# EAGLE schematic robot (EAGLE 8.3.0)
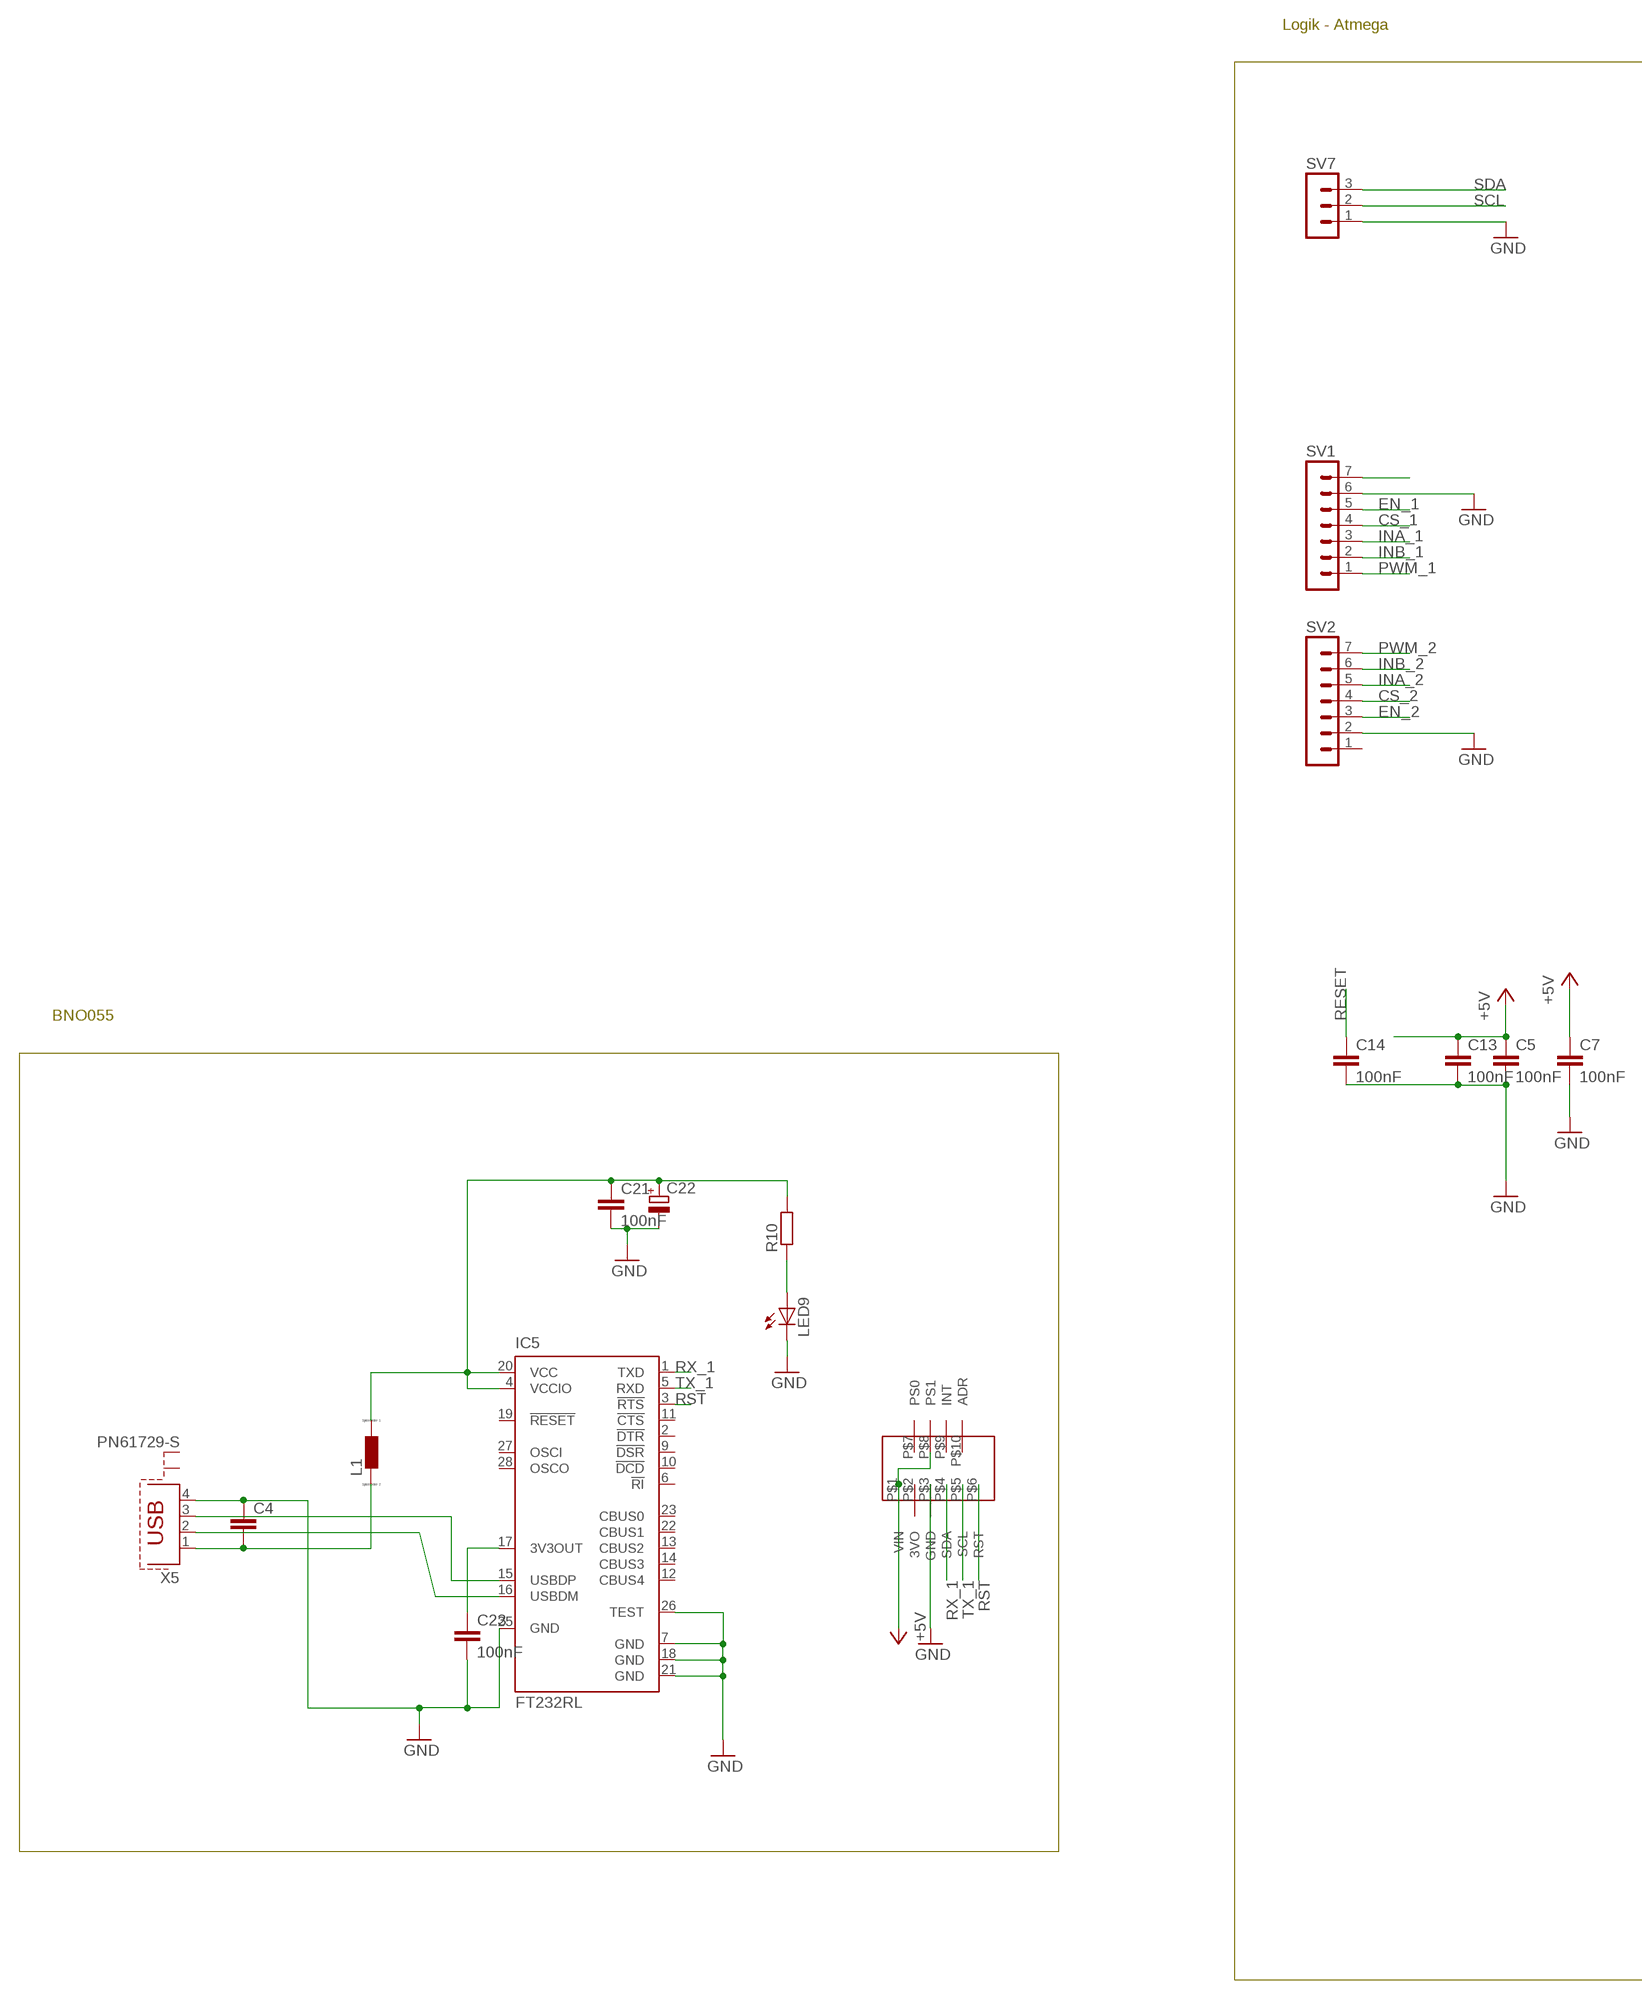
[diagram p0: schematic, sheet 1, part 1 of 3]
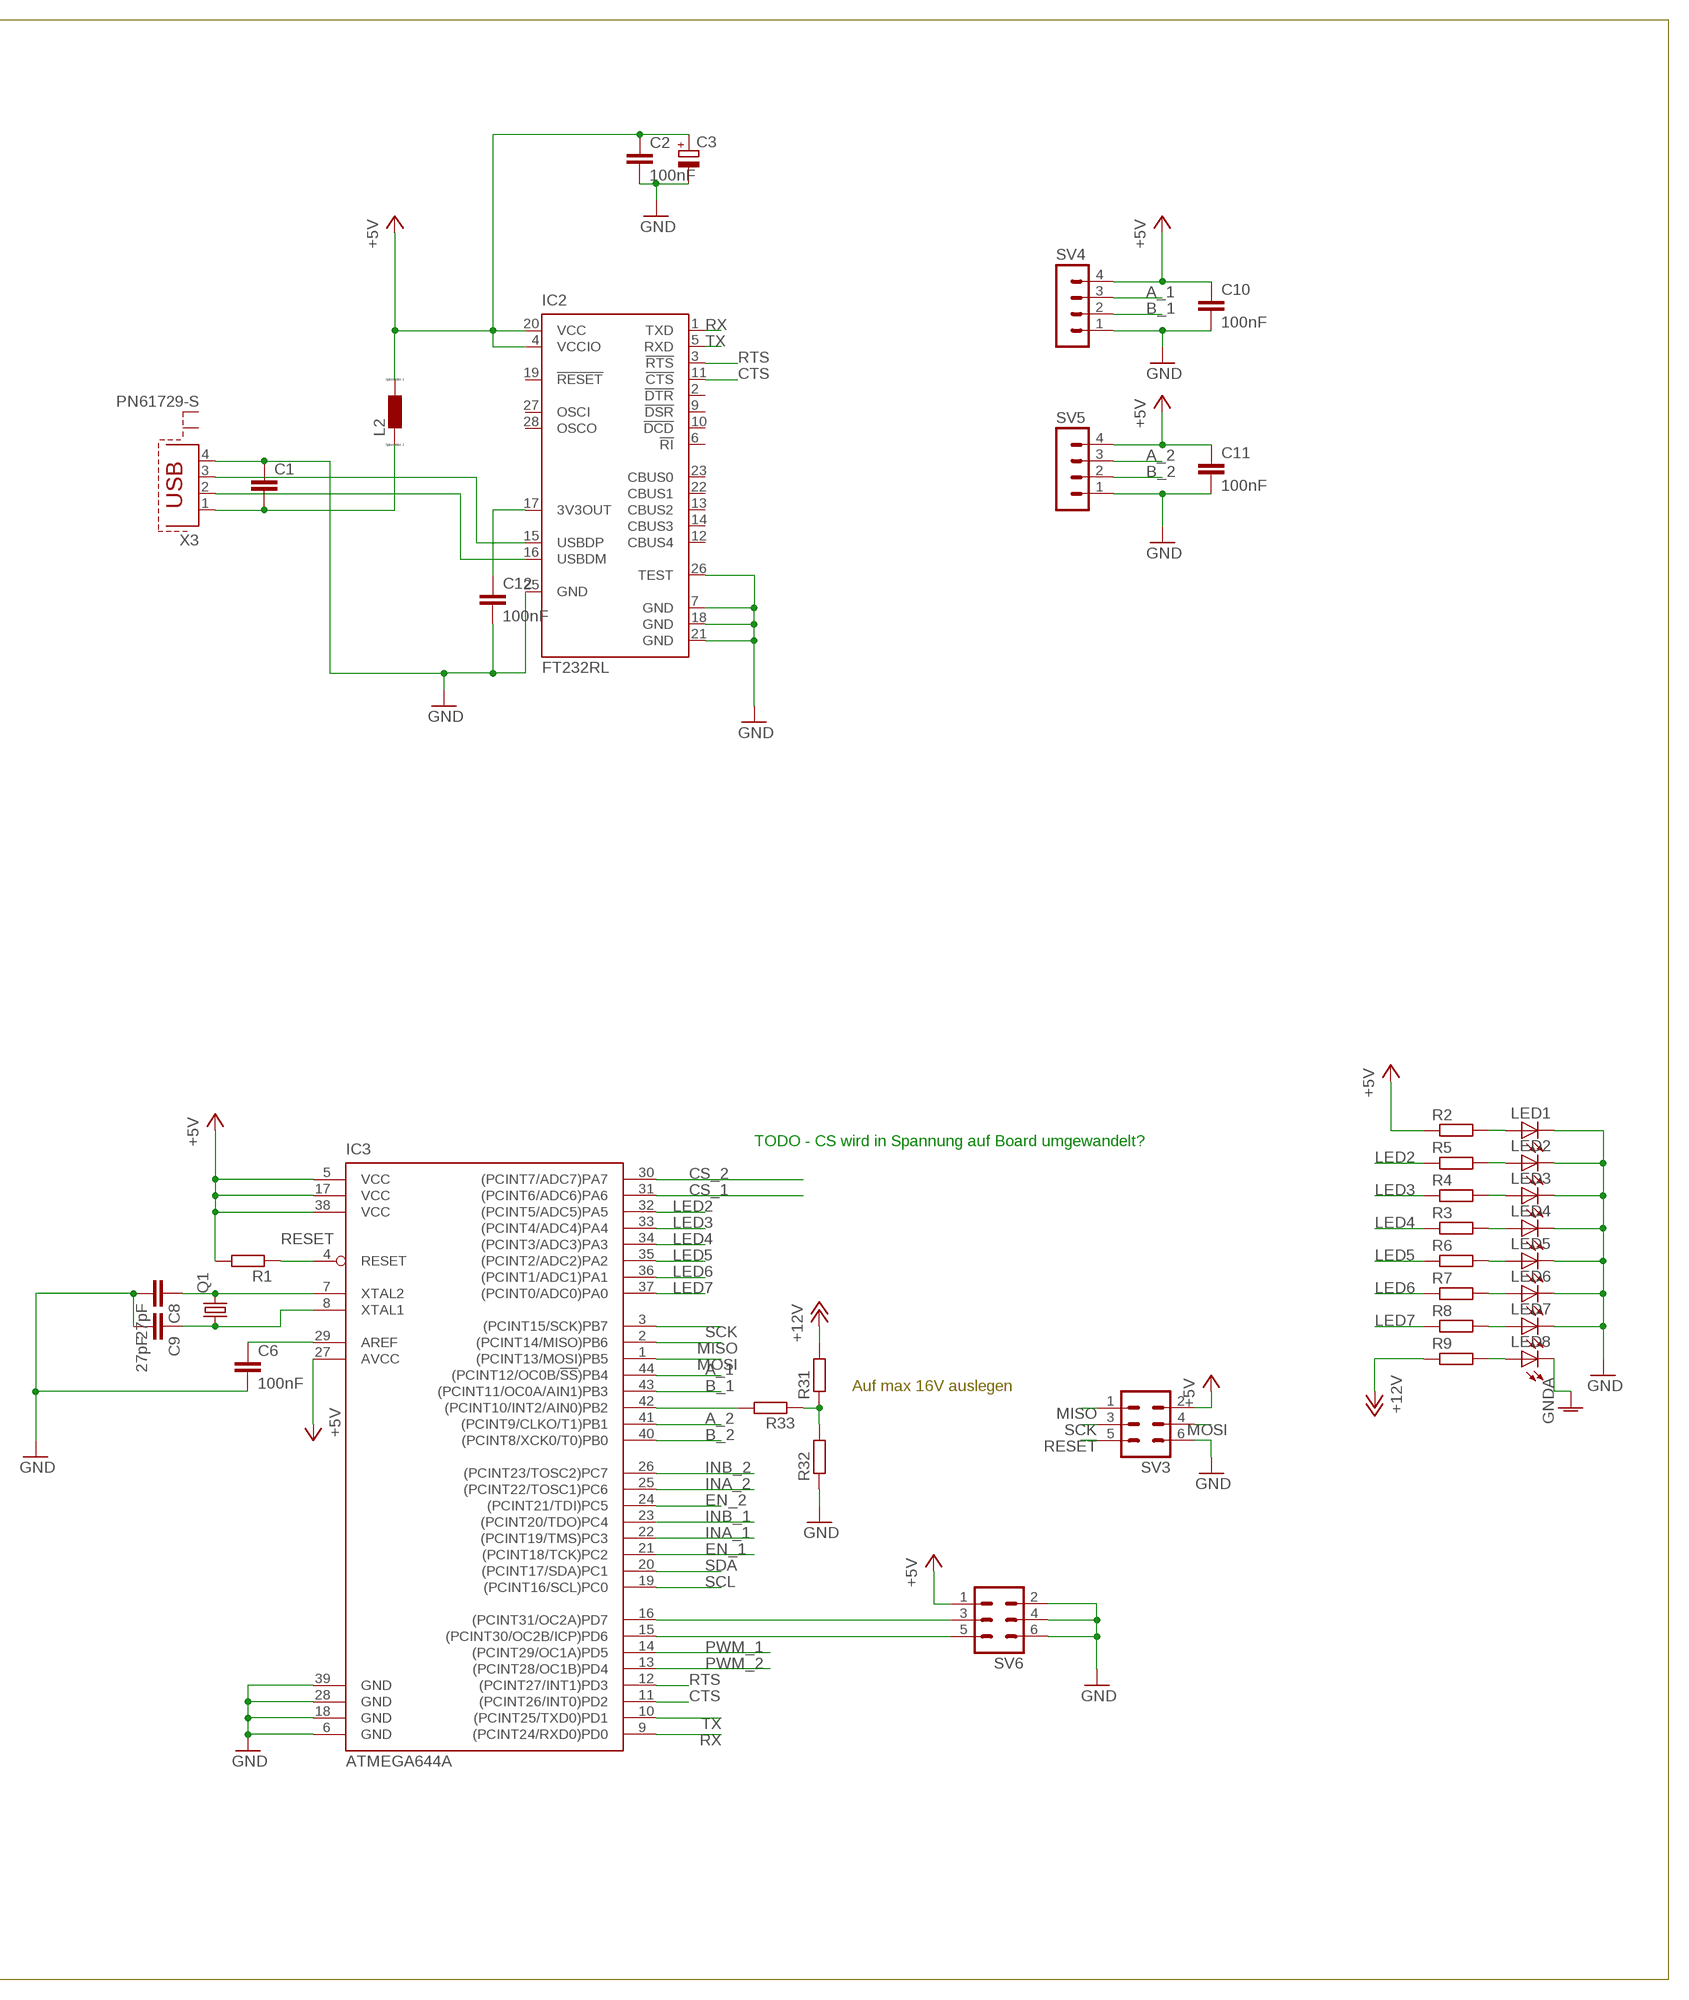
[diagram p1: schematic, sheet 1, part 2 of 3]
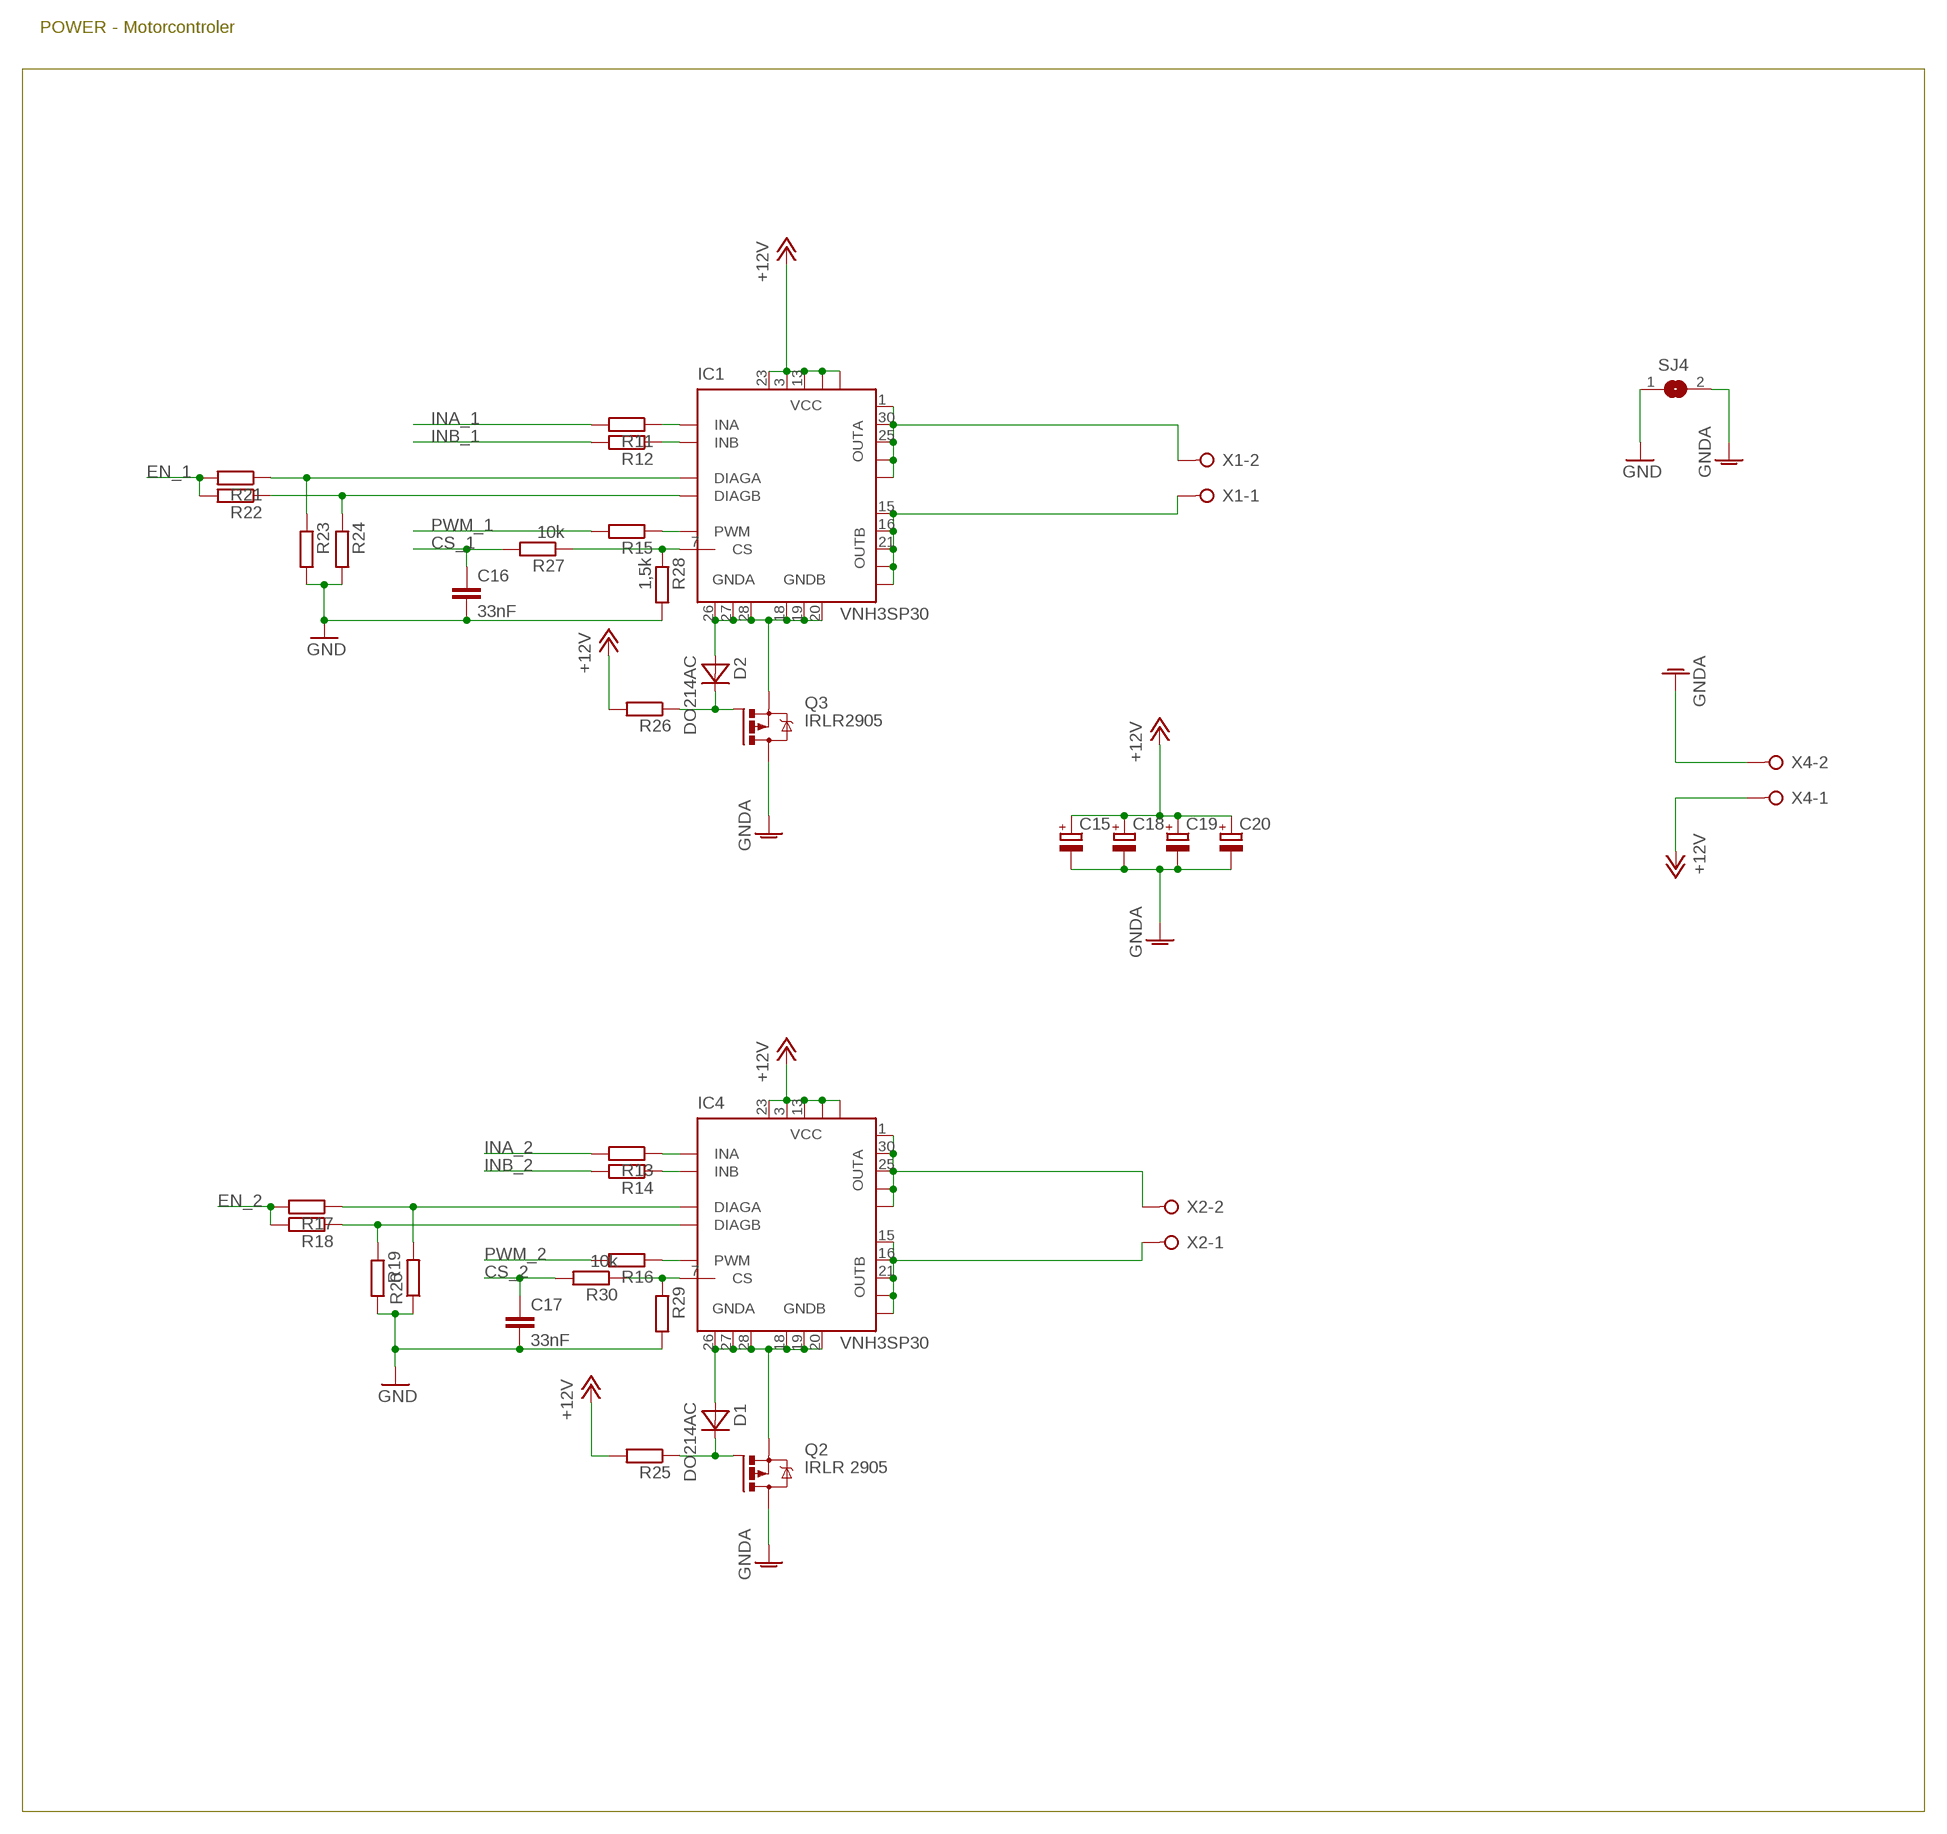
[diagram p2: schematic, sheet 1, part 3 of 3]

## Parts
C1  C-EUC0805  [C0805]
C2  100nF  C-EUC0805  [C0805]
C3  CPOL-EU153CLV-0810  [153CLV-0810]
C4  C-EUC0805  [C0805]
C5  100nF  C-EUC0805  [C0805]
C6  100nF  C-EUC0805  [C0805]
C7  100nF  C-EUC0805  [C0805]
C8  27pF  C-EUC0805  [C0805]
C9  27pF  C-EUC0805  [C0805]
C10  100nF  C-EUC0805  [C0805]
C11  100nF  C-EUC0805  [C0805]
C12  100nF  C-EUC0805  [C0805]
C13  100nF  C-EUC0805  [C0805]
C14  100nF  C-EUC0805  [C0805]
C15  CPOL-EU153CLV-0810  [153CLV-0810]
C16  33nF  C-EUC0805  [C0805]
C17  33nF  C-EUC0805  [C0805]
C18  CPOL-EU153CLV-0810  [153CLV-0810]
C19  CPOL-EU153CLV-0810  [153CLV-0810]
C20  CPOL-EU153CLV-0810  [153CLV-0810]
C21  100nF  C-EUC0805  [C0805]
C22  CPOL-EU153CLV-0810  [153CLV-0810]
C23  100nF  C-EUC0805  [C0805]
D1  DO214AC  MBRA340T3  [SMA]
D2  DO214AC  MBRA340T3  [SMA]
IC1  VNH3SP30  [MULTIPOWERSO-30]
IC2  FT232RL  [SSOP28]
IC3  ATMEGA644A  [TQFP44]
IC4  VNH3SP30  [MULTIPOWERSO-30]
IC5  FT232RL  [SSOP28]
L1  LL4532C  [L4532M]
L2  LL4532C  [L4532M]
LED1  LEDCHIPLED_0805  [CHIPLED_0805]
LED2  LEDCHIPLED_0805  [CHIPLED_0805]
LED3  LEDCHIPLED_0805  [CHIPLED_0805]
LED4  LEDCHIPLED_0805  [CHIPLED_0805]
LED5  LEDCHIPLED_0805  [CHIPLED_0805]
LED6  LEDCHIPLED_0805  [CHIPLED_0805]
LED7  LEDCHIPLED_0805  [CHIPLED_0805]
LED8  LEDCHIPLED_0805  [CHIPLED_0805]
LED9  LEDCHIPLED_0805  [CHIPLED_0805]
Q1  CRYSTALHC49UP  [HC49UP]
Q2  IRLR 2905  IRFR5305  [D-PAK_TO252AA]
Q3  IRLR2905  IRFR5305  [D-PAK_TO252AA]
R1  R-EU_M0805  [M0805]
R2  R-EU_M0805  [M0805]
R3  R-EU_M0805  [M0805]
R4  R-EU_M0805  [M0805]
R5  R-EU_M0805  [M0805]
R6  R-EU_M0805  [M0805]
R7  R-EU_M0805  [M0805]
R8  R-EU_M0805  [M0805]
R9  R-EU_M0805  [M0805]
R10  R-EU_M0805  [M0805]
R11  R-EU_M0805  [M0805]
R12  R-EU_M0805  [M0805]
R13  R-EU_M0805  [M0805]
R14  R-EU_M0805  [M0805]
R15  R-EU_M0805  [M0805]
R16  R-EU_M0805  [M0805]
R17  R-EU_M0805  [M0805]
R18  R-EU_M0805  [M0805]
R19  R-EU_M0805  [M0805]
R20  R-EU_M0805  [M0805]
R21  R-EU_M0805  [M0805]
R22  R-EU_M0805  [M0805]
R23  R-EU_M0805  [M0805]
R24  R-EU_M0805  [M0805]
R25  R-EU_M0805  [M0805]
R26  R-EU_M0805  [M0805]
R27  10k  R-EU_M0805  [M0805]
R28  1,5k  R-EU_M0805  [M0805]
R29  R-EU_M0805  [M0805]
R30  10k  R-EU_M0805  [M0805]
R31  R-EU_M0805  [M0805]
R32  R-EU_M0805  [M0805]
R33  R-EU_M0805  [M0805]
SJ4  SJ  [SJ]
SV1  MA07-1  [MA07-1]
SV2  MA07-1  [MA07-1]
SV3  ML6  [ML6]
SV4  MA04-1  [MA04-1]
SV5  MA04-1  [MA04-1]
SV6  ML6  [ML6]
SV7  MA03-1  [MA03-1]
U$1  BNO055  [BNO055_ADA]
X1  W237-02P  [W237-132]
X2  W237-02P  [W237-132]
X3  PN61729-S  [PN61729-S]
X4  W237-02P  [W237-132]
X5  PN61729-S  [PN61729-S]

## Nets
+5V: C2.1 C3.+ C5.1 C7.1 C10.1 C11.1 C13.1 IC2.4(VCCIO) IC2.20(VCC) IC3.5(VCC) IC3.17(VCC) IC3.27(AVCC) IC3.38(VCC) L2.1 R1.2 R2.1 SV3.2 SV4.4 SV5.4 SV6.1 U$1.P$1(VIN) U$1.P$8(PS1)
+12V: C15.+ C18.+ C19.+ C20.+ IC1.3(VCC) IC1.13(VCC) IC1.23(VCC) IC1.VCC IC1.VCC@1(VCC) IC4.3(VCC) IC4.13(VCC) IC4.23(VCC) IC4.VCC IC4.VCC@1(VCC) R9.1 R25.2 R26.2 R31.2 X4.1
A_1: IC3.44((PCINT12/OC0B/!SS!)PB4) SV4.3
A_2: IC3.41((PCINT9/CLKO/T1)PB1) SV5.3
B_1: IC3.43((PCINT11/OC0A/AIN1)PB3) SV4.2
B_2: IC3.40((PCINT8/XCK0/T0)PB0) SV5.2
CS_1: C16.1 IC3.31((PCINT6/ADC6)PA6) R27.2 SV1.4
CS_2: C17.1 IC3.30((PCINT7/ADC7)PA7) R30.2 SV2.4
CTS: IC2.11(!CTS) IC3.11((PCINT26/INT0)PD2)
EN_1: IC3.21((PCINT18/TCK)PC2) R21.2 R22.2 SV1.5
EN_2: IC3.24((PCINT21/TDI)PC5) R17.2 R18.2 SV2.3
GND: C1.1 C2.2 C3.- C4.1 C5.2 C6.2 C7.2 C8.2 C9.2 C10.2 C11.2 C12.2 C13.2 C14.2 C16.2 C17.2 C21.2 C22.- C23.2 IC2.7(GND) IC2.18(GND) IC2.21(GND) IC2.25(GND) IC2.26(TEST) IC3.6(GND) IC3.18(GND) IC3.28(GND) IC3.39(GND) IC5.7(GND) IC5.18(GND) IC5.21(GND) IC5.25(GND) IC5.26(TEST) LED1.C LED2.C LED3.C LED4.C LED5.C LED6.C LED7.C LED9.C R19.2 R20.1 R23.2 R24.2 R28.2 R29.2 R32.1 SJ4.1 SV1.6 SV2.2 SV3.6 SV4.1 SV5.1 SV6.2 SV6.4 SV6.6 SV7.1 U$1.P$3(GND) X3.4 X5.4
GNDA: C15.- C18.- C19.- C20.- LED8.C Q2.4(D) Q3.4(D) SJ4.2 X4.2
INA_1: IC3.22((PCINT19/TMS)PC3) R11.2 SV1.3
INA_2: IC3.25((PCINT22/TOSC1)PC6) R13.2 SV2.5
INB_1: IC3.23((PCINT20/TDO)PC4) R12.2 SV1.2
INB_2: IC3.26((PCINT23/TOSC2)PC7) R14.2 SV2.6
LED2: IC3.32((PCINT5/ADC5)PA5) R5.1
LED3: IC3.33((PCINT4/ADC4)PA4) R4.1
LED4: IC3.34((PCINT3/ADC3)PA3) R3.1
LED5: IC3.35((PCINT2/ADC2)PA2) R6.1
LED6: IC3.36((PCINT1/ADC1)PA1) R7.1
LED7: IC3.37((PCINT0/ADC0)PA0) R8.1
MISO: IC3.2((PCINT14/MISO)PB6) SV3.1
MOSI: IC3.1((PCINT13/MOSI)PB5) SV3.4
N$1: SV1.7
N$2: LED1.A R2.2
N$3: IC2.16(USBDM) X3.2
N$4: IC2.15(USBDP) X3.3
N$5: LED4.A R3.2
N$6: LED3.A R4.2
N$7: C8.1 IC3.7(XTAL2) Q1.2
N$8: C9.1 IC3.8(XTAL1) Q1.1
N$9: LED2.A R5.2
N$10: C6.1 IC3.29(AREF)
N$11: LED5.A R6.2
N$12: LED6.A R7.2
N$13: LED7.A R8.2
N$14: C1.2 L2.2 X3.1
N$15: LED8.A R9.2
N$16: LED9.A R10.1
N$17: C12.1 IC2.17(3V3OUT)
N$18: IC4.5(INA) R13.1
N$19: IC5.16(USBDM) X5.2
N$20: IC4.11(INB) R14.1
N$21: IC4.8(PWM) R16.1
N$22: IC1.5(INA) R11.1
N$23: IC1.11(INB) R12.1
N$24: IC1.8(PWM) R15.1
N$25: IC4.6(DIAGA) R17.1 R20.2
N$26: IC4.10(DIAGB) R18.1 R19.1
N$27: D2.A IC1.18(GNDB) IC1.19(GNDB) IC1.20(GNDB) IC1.26(GNDA) IC1.27(GNDA) IC1.28(GNDA) Q3.3(S)
N$28: IC1.6(DIAGA) R21.1 R23.1
N$29: IC1.10(DIAGB) R22.1 R24.1
N$30: D1.A IC4.18(GNDB) IC4.19(GNDB) IC4.20(GNDB) IC4.26(GNDA) IC4.27(GNDA) IC4.28(GNDA) Q2.3(S)
N$31: D1.C Q2.1(G) R25.1
N$32: D2.C Q3.1(G) R26.1
N$33: IC4.1(OUTA) IC4.25(OUTA) IC4.30(OUTA) IC4.OUTA IC4.OUTA@1(OUTA) X2.2
N$34: IC4.15(OUTB) IC4.16(OUTB) IC4.21(OUTB) IC4.OUTB IC4.OUTB@1(OUTB) X2.1
N$35: IC1.15(OUTB) IC1.16(OUTB) IC1.21(OUTB) IC1.OUTB IC1.OUTB@1(OUTB) X1.1
N$36: IC1.1(OUTA) IC1.25(OUTA) IC1.30(OUTA) IC1.OUTA IC1.OUTA@1(OUTA) X1.2
N$37: IC1.7(CS) R27.1 R28.1
N$38: IC4.7(CS) R29.1 R30.1
N$39: IC5.15(USBDP) X5.3
N$40: C4.2 L1.2 X5.1
N$41: C23.1 IC5.17(3V3OUT)
N$42: C21.1 C22.+ IC5.4(VCCIO) IC5.20(VCC) L1.1 R10.2
N$43: IC3.16((PCINT31/OC2A)PD7) SV6.3
N$44: IC3.15((PCINT30/OC2B/ICP)PD6) SV6.5
N$45: R31.1 R32.2 R33.1
N$46: IC3.42((PCINT10/INT2/AIN0)PB2) R33.2
PWM_1: IC3.14((PCINT29/OC1A)PD5) R15.2 SV1.1
PWM_2: IC3.13((PCINT28/OC1B)PD4) R16.2 SV2.7
RESET: C14.1 IC3.4(RESET) R1.1 SV3.5
RST: IC5.3(!RTS) U$1.P$6(RST)
RTS: IC2.3(!RTS) IC3.12((PCINT27/INT1)PD3)
RX: IC2.1(TXD) IC3.9((PCINT24/RXD0)PD0)
RX_1: IC5.1(TXD) U$1.P$4(SDA)
SCK: IC3.3((PCINT15/SCK)PB7) SV3.3
SCL: IC3.19((PCINT16/SCL)PC0) SV7.2
SDA: IC3.20((PCINT17/SDA)PC1) SV7.3
TX: IC2.5(RXD) IC3.10((PCINT25/TXD0)PD1)
TX_1: IC5.5(RXD) U$1.P$5(SCL)
Unconnected: IC2.2(!DTR) IC2.6(!RI) IC2.9(!DSR) IC2.10(!DCD) IC2.12(CBUS4) IC2.13(CBUS2) IC2.14(CBUS3) IC2.19(!RESET) IC2.22(CBUS1) IC2.23(CBUS0) IC2.27(OSCI) IC2.28(OSCO) IC5.2(!DTR) IC5.6(!RI) IC5.9(!DSR) IC5.10(!DCD) IC5.11(!CTS) IC5.12(CBUS4) IC5.13(CBUS2) IC5.14(CBUS3) IC5.19(!RESET) IC5.22(CBUS1) IC5.23(CBUS0) IC5.27(OSCI) IC5.28(OSCO) SV2.1 U$1.P$2(3VO) U$1.P$7(PS0) U$1.P$9(INT) U$1.P$10(ADR) X3.S1 X3.S2 X5.S1 X5.S2

## Notes on the sheet
- Logik - Atmega
- BNO055
- TODO - CS wird in Spannung auf Board umgewandelt?
- Auf max 16V auslegen
- POWER - Motorcontroler

## Library data of the parts
C1 C2 C4-C14 C16 C17 C21 C23 = rcl:C-EU: CAPACITOR, European symbol
C3 C15 C18-C20 C22 = rcl:CPOL-EU: POLARIZED CAPACITOR, European symbol
D1 D2 = diode:MBRA340T3: Surface Mount Schottky Power Rectifier Source: http://www.onsemi.com/pub_link/Collateral/MBRA340T3-D.PDF
IC1 IC4 = st-microelectronics:VNH3SP30: FULLY INTEGRATED H-BRIDGE MOTOR DRIVER Source: http://pdf1.alldatasheet.com/datasheet-pdf/view/84563/STMICROELECTRONICS/VNH3SP30.html
IC2 IC5 = ftdichip:FT232R: Source: http://www.ftdichip.com/Documents/DataSheets/DS_FT232R_v104.pdf; MPN: FT232RL; OC_FARNELL: 1146032; OC_NEWARK: 91K9918
IC3 = atmel:ATMEGA644: 8-bit Microcontroller with 64K Bytes In-System Programmable Flash Source: http://www.atmel.com/dyn/resources/prod_documents/doc2593.pdf; MPN: ATMEGA644PV-10AU; OC_FARNELL: 1455123; OC_NEWARK: 58M3748
L1 L2 = eagle-ltspice:L: INDUCTOR, European symbol; SPICEMODEL: NONE; SPICEPREFIX: L
LED1-LED9 = led:LED: LED OSRAM: - CHIPLED LG R971, LG N971, LY N971, LG Q971, LY Q971, LO R971, LY R971 LH N974, LH R974 LS Q976, LO Q976, LY Q976 LO Q996 - Hyper CHIPLED LW Q18S LB Q993, LB Q99A, LB R99A - SideLED LS A670, LO A670, LY A670, LG A670, LP A670 LB A673, LV A673, LT A673, LW A673 LH A674 LY A675 LS A676, LA A676, LO A676, LY A676, LW A676 LS A679, LY A679, LG A679 - Hyper Micro SIDELED® LS Y876, LA Y876, LO Y876, LY Y876 LT Y87S - SmartLED LW L88C, LW L88S LB L89C, LB L89S, LG L890 LS L89K, LO L89K, LY L89K LS L896, LA L896, LO L896, LY L896 - TOPLED LS T670, LO T670, LY T670, LG T670, LP T670 LSG T670, LSP T670, LSY T670, LOP T670, LYG T670 LG T671, LOG T671, LSG T671 LB T673, LV T673, LT T673, LW T673 LH T674 LS T676, LA T676, LO T676, LY T676, LB T676, LH T676, LSB T676, LW T676 LB T67C, LV T67C, LT T67C, LS T67K, LO T67K, LY T67K, LW E67C LS E67B, LA E67B, LO E67B, LY E67B, LB E67C, LV E67C, LT E67C LW T67C LS T679, LY T679, LG T679 LS T770, LO T770, LY T770, LG T770, LP T770 LB T773, LV T773, LT T773, LW T773 LH T774 LS E675, LA E675, LY E675, LS T675 LS T776, LA T776, LO T776, LY T776, LB T776 LHGB T686 LT T68C, LB T68C - Hyper Mini TOPLED® LB M676 - Mini TOPLED Santana® LG M470 LS M47K, LO M47K, LY M47K Source: http://www.osram.convergy.de LUXEON: - LUMILED® LXK2-PW12-R00, LXK2-PW12-S00, LXK2-PW14-U00, LXK2-PW14-V00 LXK2-PM12-R00, LXK2-PM12-S00, LXK2-PM14-U00 LXK2-PE12-Q00, LXK2-PE12-R00, LXK2-PE12-S00, LXK2-PE14-T00, LXK2-PE14-U00 LXK2-PB12-K00, LXK2-PB12-L00, LXK2-PB12-M00, LXK2-PB14-N00, LXK2-PB14-P00, LXK2-PB14-Q00 LXK2-PR12-L00, LXK2-PR12-M00, LXK2-PR14-Q00, LXK2-PR14-R00 LXK2-PD12-Q00, LXK2-PD12-R00, LXK2-PD12-S00 LXK2-PH12-R00, LXK2-PH12-S00 LXK2-PL12-P00, LXK2-PL12-Q00, LXK2-PL12-R00 Source: www.luxeon.com KINGBRIGHT: KA-3528ASYC Source: www.kingbright.com
Q1 = crystal:CRYSTAL: CRYSTAL; OC_FARNELL: unknown; OC_NEWARK: unknown
Q2 Q3 = transistor-power:IRF?5305: HEXFET Power MOSFET Source: http://www.irf.com/product-info/datasheets/data/irfr5305pbf.pdf
R1-R33 = rcl:R-EU_: RESISTOR, European symbol
SJ4 = jumper:SJ: SMD solder JUMPER
SV1 SV2 = con-lstb:MA07-1: PIN HEADER; OC_FARNELL: unknown; OC_NEWARK: unknown
SV3 SV6 = con-harting-ml:ML6: HARTING; OC_FARNELL: unknown; OC_NEWARK: unknown
SV4 SV5 = con-lstb:MA04-1: PIN HEADER; OC_FARNELL: unknown; OC_NEWARK: unknown
SV7 = con-lstb:MA03-1: PIN HEADER; OC_FARNELL: unknown; OC_NEWARK: unknown
U$1 = bno055_adafruit:BNO055
X1 X2 X4 = con-wago-508:W237-02P: WAGO SREW CLAMP; OC_FARNELL: unknown; OC_NEWARK: unknown
X3 X5 = con-berg:PN61729-S: BERG USB connector; OC_FARNELL: unknown; OC_NEWARK: unknown